# Altium schematic sheet TPS53319 1.2V Buck Converter.SchDoc
size Letter; Organization: Altium Limited; Address1: L3, 12a Rodborough Rd; Address2: Frenchs Forest; Address3: NSW; Address4: Australia 2086; CopyrightYear: 2019
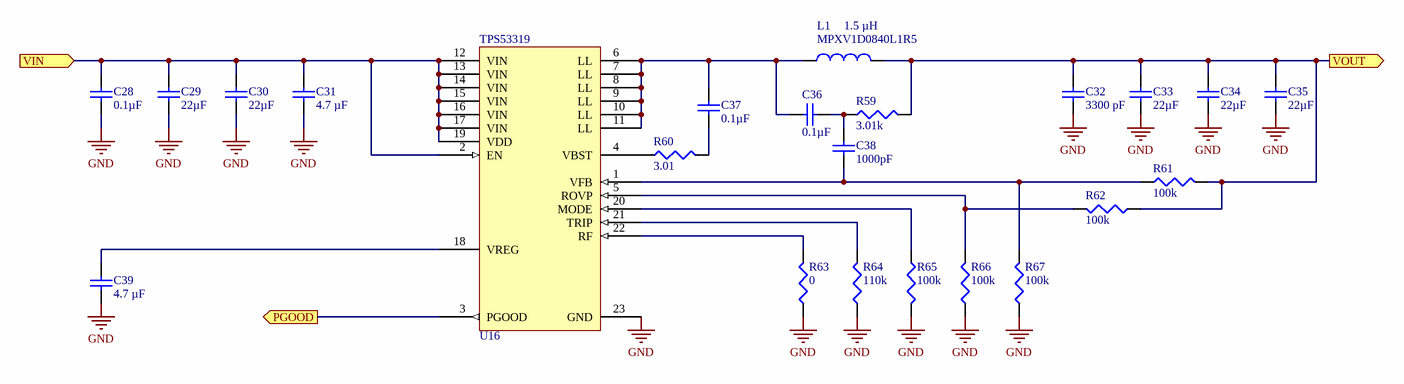
[diagram p0: TPS53319 1.2V Buck Converter.SchDoc]

## Parts
C28  value 0.1µF  [TY-TWK107]  (hidden comment: Cap)
C29  value 22µF  [TDK-C3225]  (hidden comment: Cap)
C30  value 22µF  [TDK-C3225]  (hidden comment: Cap)
C31  value 4.7 µF  [MUR-GRM188]  (hidden comment: Cap)
C32  value 3300 pF  [KEM-0402BB]  (hidden comment: Cap)
C33  value 22µF  [TDK-C3225]  (hidden comment: Cap)
C34  value 22µF  [TDK-C3225]  (hidden comment: Cap)
C35  value 22µF  [TDK-C3225]  (hidden comment: Cap)
C36  value 0.1µF  [TY-TWK107]  (hidden comment: Cap)
C37  value 0.1µF  [TY-TWK107]  (hidden comment: Cap)
C38  value 1000pF  [TDK-CGA2B]  (hidden comment: Cap)
C39  value 4.7 µF  [MUR-GRM188]  (hidden comment: Cap)
L1  value 1.5 µH  Manufacturer Part Number: MPXV1D0840L1R5  [KEM-MPXV1D0840]  (hidden comment: Inductor)
R59  value 3.01k  [VSH-CRCW0201]  (hidden comment: Res3)
R60  value 3.01  [VSH-CRCW0201]  (hidden comment: Res3)
R61  value 100k  [PANA-ERJ2R]  (hidden comment: Res3)
R62  value 100k  [PANA-ERJ2R]  (hidden comment: Res3)
R63  value 0  [PANA-ERJ2G]  (hidden comment: Jumper)
R64  value 110k  [PANA-ERJ2R]  (hidden comment: Res3)
R65  value 100k  [PANA-ERJ2R]  (hidden comment: Res3)
R66  value 100k  [PANA-ERJ2R]  (hidden comment: Res3)
R67  value 100k  [PANA-ERJ2R]  (hidden comment: Res3)
U16  TPS53319  [TI-R-PSON-N22]

## Ports
PGOOD (out), VIN (in), VOUT (out)

## Nets
GND: C28.1 C29.1 C30.1 C31.1 C32.1 C33.1 C34.1 C35.1 C39.1 R63.1 R64.1 R65.1 R66.1 R67.1 U16.23(GND)
PGOOD: U16.3(PGOOD) ; port PGOOD
VIN: C28.2 C29.2 C30.2 C31.2 U16.2(EN) U16.12(VIN) U16.13(VIN) U16.14(VIN) U16.15(VIN) U16.16(VIN) U16.17(VIN) U16.19(VDD) ; port VIN
VOUT: C32.2 C33.2 C34.2 C35.2 L1.2 R59.2 R61.2 R62.1 ; port VOUT
NetC36_1: C36.1 C38.1 R59.1
NetC36_2: C36.2 C37.2 L1.1 U16.6(LL) U16.7(LL) U16.8(LL) U16.9(LL) U16.10(LL) U16.11(LL)
NetC37_1: C37.1 R60.2
NetC38_2: C38.2 R61.1 R67.2 U16.1(VFB)
NetC39_2: C39.2 U16.18(VREG)
NetR60_1: R60.1 U16.4(VBST)
NetR62_2: R62.2 R66.2 U16.5(ROVP)
NetR63_2: R63.2 U16.22(RF)
NetR64_2: R64.2 U16.21(TRIP)
NetR65_2: R65.2 U16.20(MODE)

## Notes on the sheet
- (the "License"); you may not use or redistribute this file except in compliance with the License. You
- This file and the information within it are licensed under the terms of the Apache License, Version 2.0
- Copyright
- Unless required by applicable law or agreed to in writing, content distributed under the License is
- distributed on an "AS IS" BASIS, WITHOUT WARRANTIES OR CONDITIONS OF ANY KIND,
- either express or implied. See the License for the specific language governing permissions and
- limitations under the License.
- may obtain a copy of the License at:
- http://www.apache.org/licenses/LICENSE-2.0
- Title
- Size:
- Date:
- Letter
- Number:
- Time:
- Revision:
- Sheet
- of
- University of Alberta
- Deptartment of Electrical
- and Computer Engineering
- Edmonton AB, Canada
- T6G 1H9
- File:

## Library data of the parts
C28 C36 C37 = PC-TY-00817: CAP CER 0.1UF 25V X7R 0306; Manufacturer Part Number: TWK107B7104MVHT; Index: 817; Designator: C?; Tolerance: ±20%; Published: 2022-12-10; LatestRevisionDate: 2022-12-10; LatestRevisionNote: ...; PackageReference: 0306 (0816 Metric); Publisher: AlbertaSat; PackageDescription: Chip Capacitor, 2-Leads, Body 0.80x1.60mm, IPC Low Density; Part Number: PC-TY-00817; Supplier Part Number 1: 587-6181-1-ND; Supplier 1: Digi-key; Supplier Part Number 2: 963-TWK107B7104MVHT; Supplier 2: Mouser; Supplier Link: #https://www.digikey.ca/en/products/detail/taiyo-yuden/TWK107B7104MVHT/7403736#; Voltage-Rated: 25V; Temperature Coefficient: X7R; Application: Automotive; Operating Temperature: -55°C ~ 125°C
C29 C30 C33-C35 = PC-TDK-02965: CAP CER 22UF 25V X7R 1210; Manufacturer Part Number: C3225X7R1E226M250AB; Index: 2965; Designator: C?; Tolerance: ±20%; Code_IEC: 3225; Published: 2022-10-26; LatestRevisionDate: 2022-10-26; LatestRevisionNote: ...; PackageReference: 1210 (3225 Metric); Publisher: AlbertaSat; PackageDescription: Chip Capacitor, 2-Leads, Body 3.20x2.50mm, IPC Low Density; Part Number: PC-TDK-02965; Supplier Part Number 1: 445-181602-1-ND; Supplier 1: Digi-key; Supplier Part Number 2: 810-C3225X7R1EM250AB; Supplier 2: Mouser; Supplier Link: #https://www.digikey.ca/en/products/detail/tdk-corporation/C3225X7R1E226M250AB/9991387#; Voltage - Rated: 25V; Temperature Coefficient: X7R; Applications: General Purpose; Code_JEITA: 1210; Operating Temperature: -55°C ~ 125°C
C31 C39 = 10165: CAP CER 4.7UF 16V X7R 0603; Part Number: 10165; Manufacturer Part Number: GRM188Z71C475KE21D; Designator: C?; Tolerance: ±10%; Voltage - Rated: 25V; Published: 8-Jun-2000; LatestRevisionDate: 17-Jul-2002; LatestRevisionNote: Re-released for DXP Platform.; PackageReference: 0603 (1608 Metric); Publisher: Altium Limited; PackageDescription: Chip Capacitor, 2-Leads, Body 1.60x0.80mm, IPC Low Density; Supplier Part Number 1: 490-GRM188Z71C475KE21DCT-ND; Supplier 1: Digi-Key; Supplier Link: #https://www.digikey.ca/en/products/detail/murata-electronics/GRM188Z71C475KE21D/13401930#; Temperature Coefficient: X7R; Application: General Purpose; Operating Temperature: -55°C ~ 125°C; Supplier 2: Mouser; Supplier Part Number 2: 81-GRM188Z71C475KE1D
C32 = PC-KEM-03166: CAP CER 3300PF 50V X7R 0402; Manufacturer Part Number: C0402C332K5RAC7867; Index: 3166; Designator: C?; Tolerance: ±10%; Published: 2022-10-26; LatestRevisionDate: 2023-05-04; LatestRevisionNote: Added operating temperature; PackageReference: 0402 (1005 Metric); Publisher: AlbertaSat; PackageDescription: Chip Capacitor, 2-Leads, Body 1.00x0.50mm, IPC Low Density; Part Number: PC-KEM-03166; Supplier Part Number 1: 399-C0402C332K5RAC7867CT-ND; Supplier 1: Digi-key; Supplier Part Number 2: 80-C0402C332K5RAC; Supplier 2: Mouser; Supplier Link: #https://www.digikey.ca/en/products/detail/kemet/C0402C332K5RAC7867/501972?s=N4IgTCBcDaIMwE4EFoDCAGALOsq5zAGkBWAJQEFUB2ADgDYrUAVZAOQBEQBdAXyA#; Voltage - Rated: 50V; Temperature Coefficient: X7R; Applications: Bypass, Decoupling; Operating Temperature: -55°C ~ 125°C
C38 = PC-TDK-01454: CAP CER 1000PF 100V C0G 0402; Manufacturer Part Number: CGA2B1C0G2A102J050BC; Index: 1454; Designator: C?; Tolerance: ±5%; Temperature Coefficient: NP0; Published: 2016-03-16; LatestRevisionDate: 2016-03-16; LatestRevisionNote: ...; PackageReference: 0402 (1005 Metric); Publisher: AlbertaSat; PackageDescription: Radial Cap, Thru-Hole; 2 Leads; 0.3 in Pin Spacing; Part Number: PC-TDK-01454; Supplier Part Number 1: 445-172682-1-ND; Supplier 1: Digi-key; Supplier Link: http://www.digikey.ca/product-search/en?keywords=445-172682-1-ND; Voltage - Rated: 100V; Applications: Automotive; Operating Temperature: -55°C ~ 125°C
L1 = PL-KEM-03165: FIXED IND 1.5UH 16.2A 6.8MOHM SM; Code_IEC: 1005; Index: 3165; Designator: L?; Tolerance: ±20%; Published: 2022-10-26; LatestRevisionDate: 2023-05-04; LatestRevisionNote: Added operating temperature; PackageReference: 0.341" L x 0.315" W (8.65mm x 8.00mm); Publisher: AlbertaSat; PackageDescription: Precision Wire Wound Inductor, 2-Leads, Body 8.65x8.00mm, IPC Low Density; Code_JEITA: 0402; Part Number: PL-KEM-03165; Supplier Part Number 1: 399-MPXV1D0840L1R5CT-ND; Supplier 1: Digi-key; Supplier Part Number 2: 80-MPXV1D0840L1R5; Supplier 2: Mouser; Supplier Link: #https://www.digikey.ca/en/products/detail/kemet/MPXV1D0840L1R5/11314594?s=N4IgTCBcDaILIAUAaA1AjAEQAwA4AsWAMmgEoCsIAugL5A#; Operating Temperature: -55°C ~ 155°C
R59 = PR-VSH-00325: RES SMD 3.01K OHM 1% 1/20W 0201; Manufacturer Part Number: CRCW02013K01FKED; Index: 325; Designator: R?; Power - Rated: 0.05W, 1/20W; Temperature Coefficient: ±100ppm/°C; Published: 2022-12-11; LatestRevisionDate: 2022-12-11; LatestRevisionNote: ...; PackageReference: 0201 (0603 Metric); Publisher: AlbertaSat; PackageDescription: Chip Resistor, 2-Leads, Body 0.60x0.30mm, IPC Low Density; Part Number: PR-VSH-00325; Supplier Part Number 1: 541-3.01KAABCT-ND; Supplier 1: Digi-key; Supplier Part Number 2: 71-CRCW02013K01FKED; Supplier 2: Mouser; Supplier Link: #https://www.digikey.ca/en/products/detail/vishay-dale/CRCW02013K01FKED/1968056#; Tolerance: ±1%; Operating Temperature: -55°C ~ 155°C
R60 = PR-VSH-00326: CRCW0201 - 200/+400 3R01 1% ET7; Manufacturer Part Number: CRCW02013R01FXED; Index: 326; Designator: R?; Power - Rated: 0.05W, 1/20W; Temperature Coefficient: -200/ +400ppm/°C; Published: 2022-12-11; LatestRevisionDate: 2022-12-11; LatestRevisionNote: ...; PackageReference: 0201 (0603 Metric); Publisher: AlbertaSat; PackageDescription: Chip Resistor, 2-Leads, Body 0.60x0.30mm, IPC Low Density; Part Number: PR-VSH-00326; Supplier Part Number 1: 541-CRCW02013R01FXEDCT-ND; Supplier 1: Digi-key; Supplier Part Number 2: CRCW02013R01FXED; Supplier 2: Avnet; Supplier Link: #https://www.digikey.ca/en/products/detail/vishay-dale/CRCW02013R01FXED/10458991#; Tolerance: ±1%; Operating Temperature: -55°C ~ 155°C
R61 R62 R65-R67 = 18739: RES SMD 100K OHM 1% 1/10W 0402; Part Number: 18739; Manufacturer Part Number: ERJ-2RKF1003X; Designator: R?; Power: 0.1W, 1/10W; Temperature Coefficient: ±100ppm/°C; Published: 8-Jun-2000; LatestRevisionDate: 29-May-2009; LatestRevisionNote: IPC-7351 Footprint Added.; PackageReference: 0402 (1005 Metric); Publisher: Altium Limited; PackageDescription: Chip Resistor, 2-Leads, Body 1.00x0.50mm, IPC Low Density; Supplier Part Number 1: P100KLCT-ND; Supplier 1: Digi-Key; Supplier Link: http://www.digikey.ca/product-search/en?keywords=P100KLCT-ND; Tolerance: ±1%; Operating Temperature: -55°C ~ 155°C
R63 = 13127: RES SMD 0.0OHM JUMPER 1/10W 0402; Part Number: 13127; Manufacturer Part Number: ERJ-2GE0R00X; Designator: R?; Power: 0.1W, 1/10W; PackageDescription: Chip Resistor, 2-Leads, Body 1.00x0.50mm, IPC Low Density; Supplier Part Number 1: P0.0JCT-ND; Supplier 1: Digi-Key; Supplier Link: http://www.digikey.ca/product-search/en?keywords=P0.0JCT-ND; PackageReference: 0402 (1005 Metric); Tolerance: Jumper; Temperature Coefficient: -; Type: Jumper; Operating Temperature: -55°C ~ 155°C; Supplier 2: Mouser; Supplier Part Number 2: 667-ERJ-2GE0R00X
R64 = 18785: RES SMD 110K OHM 1% 1/10W 0402; Part Number: 18785; Manufacturer Part Number: ERJ-2RKF1103X; Designator: R?; Power: 0.1W, 1/10W; Temperature Coefficient: ±100ppm/°C; Published: 8-Jun-2000; LatestRevisionDate: 29-May-2009; LatestRevisionNote: IPC-7351 Footprint Added.; PackageReference: 0402 (1005 Metric); Publisher: Altium Limited; PackageDescription: Chip Resistor, 2-Leads, Body 1.00x0.50mm, IPC Low Density; Supplier Part Number 1: P110KLCT-ND; Supplier 1: Digi-Key; Supplier Link: http://www.digikey.ca/product-search/en?keywords=P110KLCT-ND; Tolerance: ±1%; Operating Temperature: -55°C ~ 155°C
U16 = 145: IC REG BUCK ADJUSTABLE 14A 22SON; Part Number: 145; Designator: U?; Supplier Part Number 2: 595-TPS53319DQPT; Supplier 2: Mouser; Manufacturer Part Number: TPS53319DQPT; Supplier Part Number 1: 296-39410-1-ND; Supplier 1: Digi-Key; Supplier Link: #https://www.digikey.ca/en/products/detail/texas-instruments/TPS53319DQPT/3471186#; PackageReference: TI-R-PSON-N22; Operating Temperature: -40°C ~ 85°C (TA)